# Altium schematic sheet top.SchDoc
size A4
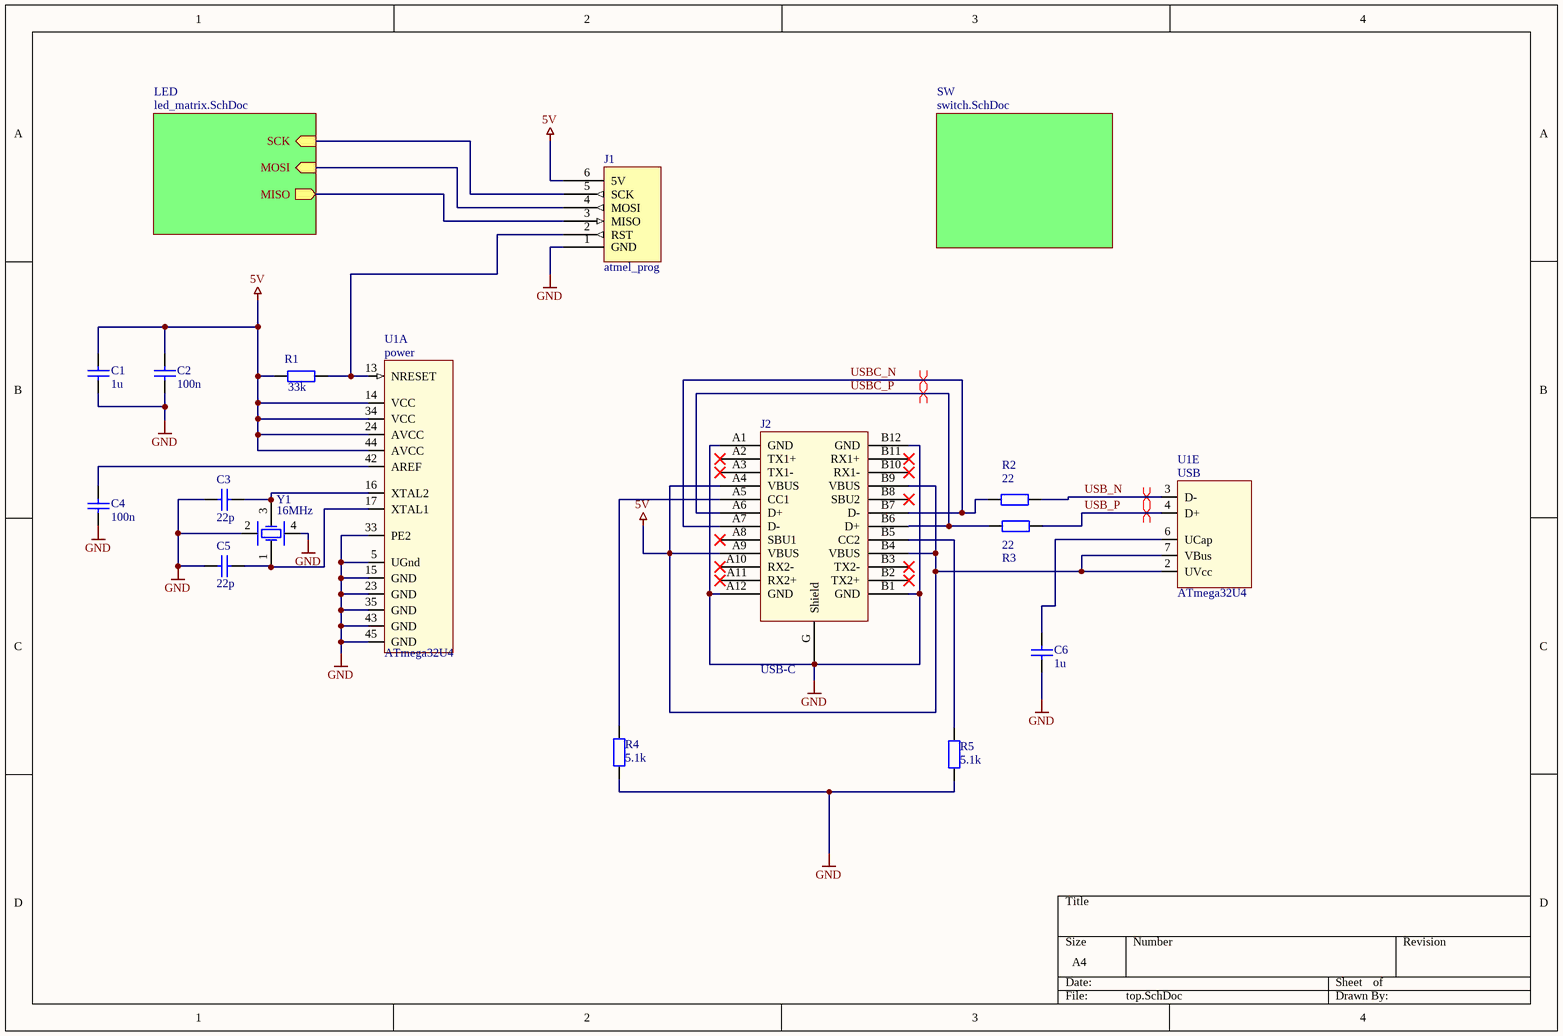
[diagram p0: top.SchDoc]

## Parts
C1  1u  [0805]
C2  100n  [0805]
C3  22p  [0805]
C4  100n  [0805]
C5  22p  [0805]
C6  1u  [0805]
J1  atmel_prog  [header6p0.2]
J2  USB-C  [usb-c]
R1  33k  [0805]
R2  22  [0805]
R3  22  [0805]
R4  5.1k  [0805]
R5  5.1k  [0805]
U1  ATmega32U4  [QFN44P05P7X7]  (parts A,E of 5)
Y1  16MHz  [SMD_crystal_P220x160S320x250]

## Sub-sheets
LED = led_matrix.SchDoc: SCK (in), MOSI (in), MISO (out)
SW = switch.SchDoc: no entries

## Nets
5V: C1.2 C2.2 J1.6(5V) J2.A4(VBUS) J2.A9(VBUS) J2.B4(VBUS) J2.B9(VBUS) R1.1 U1.2(UVcc) U1.7(VBus) U1.14(VCC) U1.24(AVCC) U1.34(VCC) U1.44(AVCC)
GND: C1.1 C2.1 C3.2 C4.1 C5.2 C6.1 J1.1(GND) J2.A1(GND) J2.A12(GND) J2.B1(GND) J2.B12(GND) J2.G(Shield) R4.2 R5.2 U1.5(UGnd) U1.15(GND) U1.23(GND) U1.33(PE2) U1.35(GND) U1.43(GND) U1.45(GND) Y1.2 Y1.4
USB_N: R2.2 U1.3(D-)
USB_P: R3.2 U1.4(D+)
USBC_N: J2.A7(D-) J2.B7(D-) R2.1
USBC_P: J2.A6(D+) J2.B6(D+) R3.1
NetC3_1: C3.1 U1.16(XTAL2) Y1.3(OSC2)
NetC4_2: C4.2 U1.42(AREF)
NetC5_1: C5.1 U1.17(XTAL1) Y1.1(OSC1)
NetC6_2: C6.2 U1.6(UCap)
NetJ1_2: J1.2(RST) R1.2 U1.13(NRESET)
NetJ1_3: J1.3(MISO) ; sheet LED/MISO
NetJ1_4: J1.4(MOSI) ; sheet LED/MOSI
NetJ1_5: J1.5(SCK) ; sheet LED/SCK
NetJ2_A5: J2.A5(CC1) R4.1
NetJ2_B5: J2.B5(CC2) R5.1

Not connected (* = marked no-connect by the designer): J2 A2(TX1+)* A3(TX1-)* A8(SBU1)* A10(RX2-)* A11(RX2+)* B2(TX2+)* B3(TX2-)* B8(SBU2)* B10(RX1-)* B11(RX1+)*

## Layout directives
differential pair: USB_N, USB_P, USBC_N, USBC_P

## Notes on the sheet
- (in symbol ATmega32U4, part A) power
- (in symbol ATmega32U4, part E) USB

## Library data of the parts
C1-C6 = cap
R1-R5 = res0805
Y1 = xtal